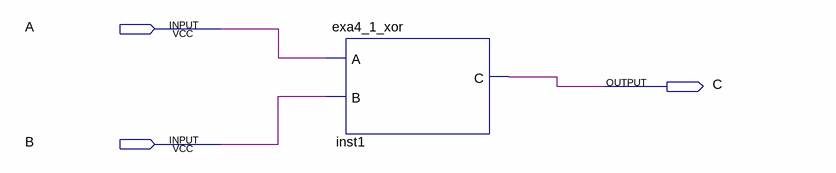
[diagram p0: schematic sheet]
// Quartus schematic experiment_four_task1.bdf as structural Verilog: 1 symbols, 3 pins
module experiment_four_task1 (
  input  A,
  input  B,
  output C
);

  exa4_1_xor inst1 (.A(A), .B(B), .C(C));
endmodule
